# Altium schematic sheet Alles_base_project.SchDoc
size A4; Organization: Blinkinlabs, LLC; DocumentNumber: 7; SheetNumber: 7; SheetTotal: 7
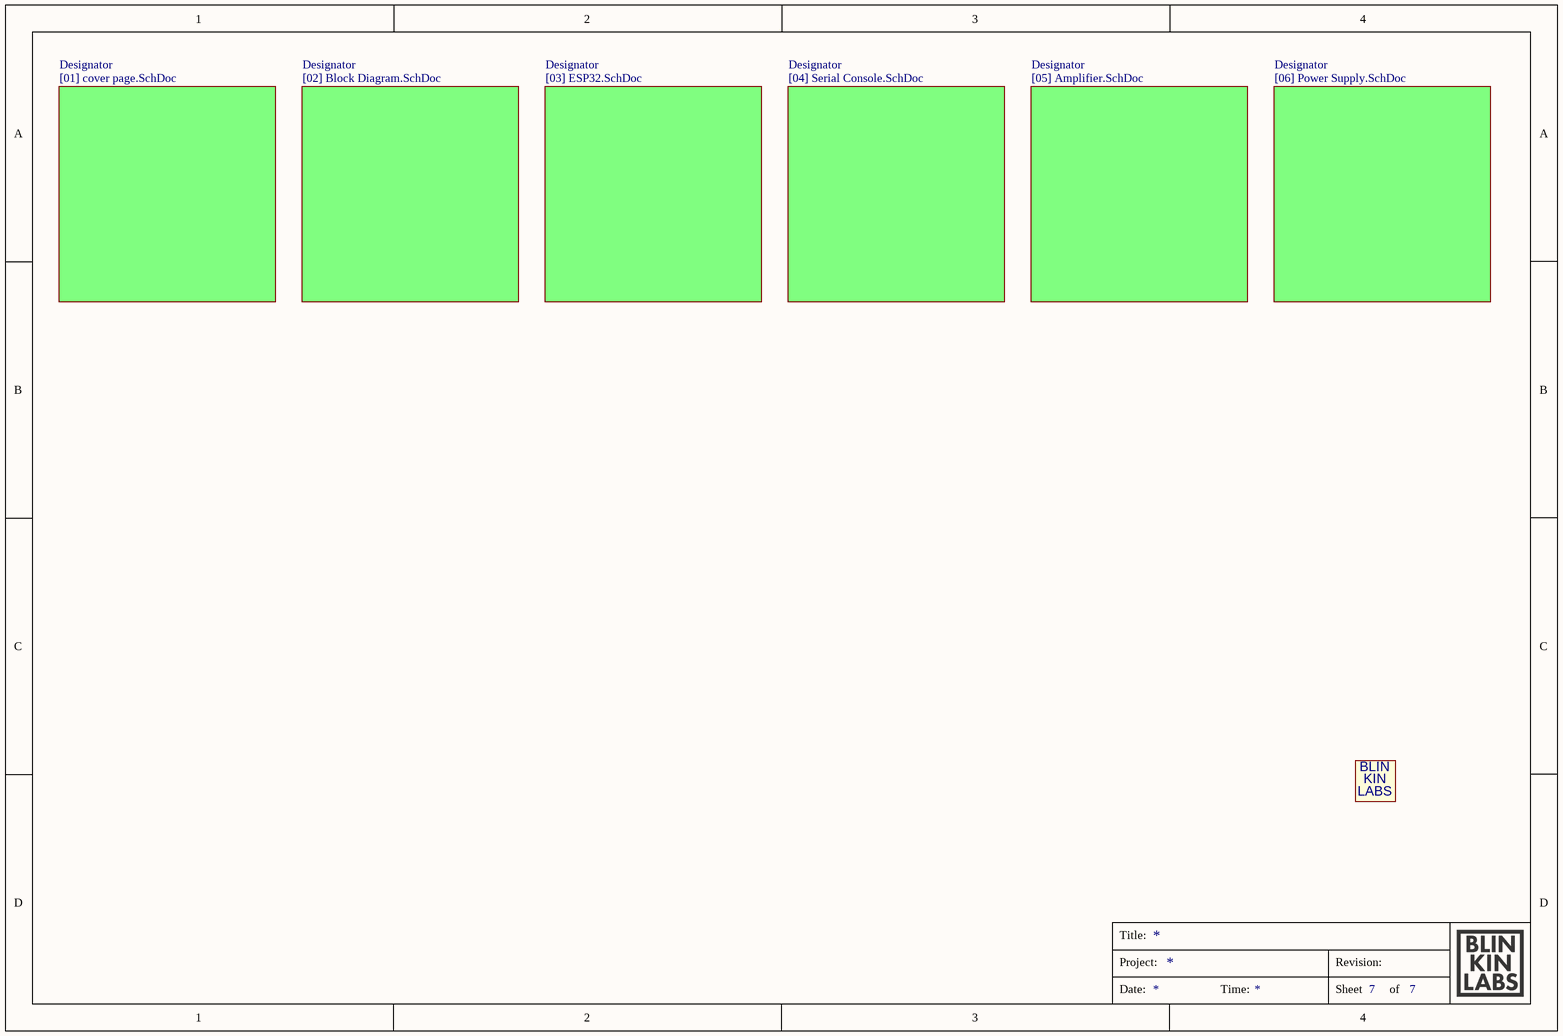
[diagram p0: Alles_base_project.SchDoc]

## Parts
L1  BLINKINLABS_LOGO  [BLINKINLABS_LOGO_SMALL]  (value not drawn)  (no BOM)

## Sub-sheets
Designator = [03] ESP32.SchDoc: no entries
Designator = [01] cover page.SchDoc: no entries
Designator = [02] Block Diagram.SchDoc: no entries
Designator = [04] Serial Console.SchDoc: no entries
Designator = [06] Power Supply.SchDoc: no entries
Designator = [05] Amplifier.SchDoc: no entries

## Notes on the sheet
- Title:
- Project:
- Revision:
- Date:
- Time:
- Sheet
- of
- (in symbol BLINKINLABS_LOGO) BLIN; KIN; LABS

## Library data of the parts
L1 = BLINKINLABS_LOGO: Square logo